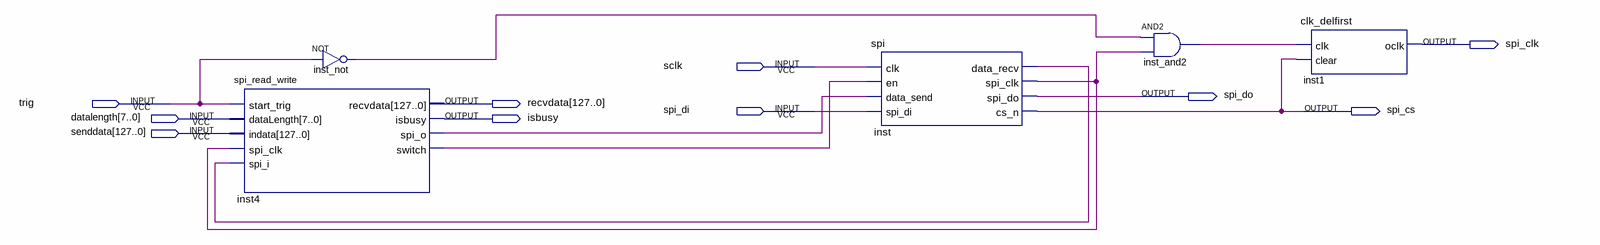
[diagram p0: schematic sheet]
// Quartus schematic flash.bdf as structural Verilog: 5 symbols, 10 pins
module flash (
  input  sclk,
  input  trig,
  input  spi_di,
  input  [7:0] datalength,
  input  [127:0] senddata,
  output spi_clk,
  output spi_do,
  output [127:0] recvdata,
  output spi_cs,
  output isbusy
);

  wire inst4_spi_o, inst4_switch, inst_and2_out, inst_data_recv, inst_not_out, inst_spi_clk;

  spi_read_write inst4 (
    .start_trig(trig), .dataLength(datalength), .indata(senddata), .spi_clk(inst_spi_clk),
    .spi_i(inst_data_recv), .recvdata(recvdata), .isbusy(isbusy), .spi_o(inst4_spi_o), .switch(inst4_switch));
  not inst_not (inst_not_out, trig);
  spi inst (
    .clk(sclk), .en(inst4_switch), .data_send(inst4_spi_o), .spi_di(spi_di), .data_recv(inst_data_recv),
    .spi_clk(inst_spi_clk), .spi_do(spi_do), .cs_n(spi_cs));
  and inst_and2 (inst_and2_out, inst_not_out, inst_spi_clk);
  clk_delfirst inst1 (.clk(inst_and2_out), .clear(spi_cs), .oclk(spi_clk));
endmodule
